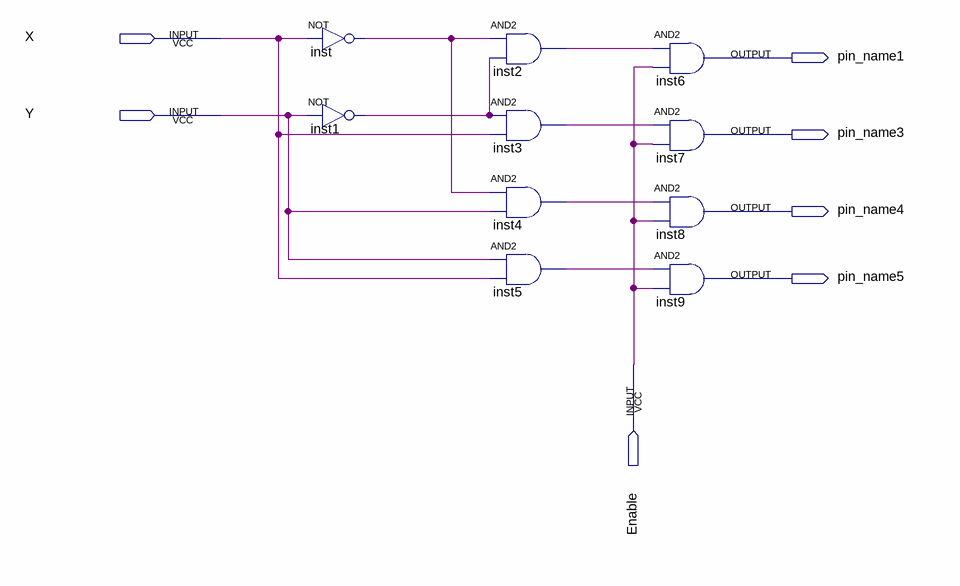
[diagram p0: schematic sheet]
// Quartus schematic decoder2to4.bdf as structural Verilog: 10 symbols, 7 pins
module decoder2to4 (
  input  X,
  input  Y,
  input  Enable,
  output pin_name1,
  output pin_name3,
  output pin_name4,
  output pin_name5
);

  wire inst1_out, inst2_out, inst3_out, inst4_out, inst5_out, inst_out;

  not inst (inst_out, X);
  not inst1 (inst1_out, Y);
  and inst2 (inst2_out, inst_out, inst1_out);
  and inst3 (inst3_out, inst1_out, X);
  and inst4 (inst4_out, inst_out, Y);
  and inst5 (inst5_out, Y, X);
  and inst6 (pin_name1, inst2_out, Enable);
  and inst7 (pin_name3, inst3_out, Enable);
  and inst8 (pin_name4, inst4_out, Enable);
  and inst9 (pin_name5, inst5_out, Enable);
endmodule
